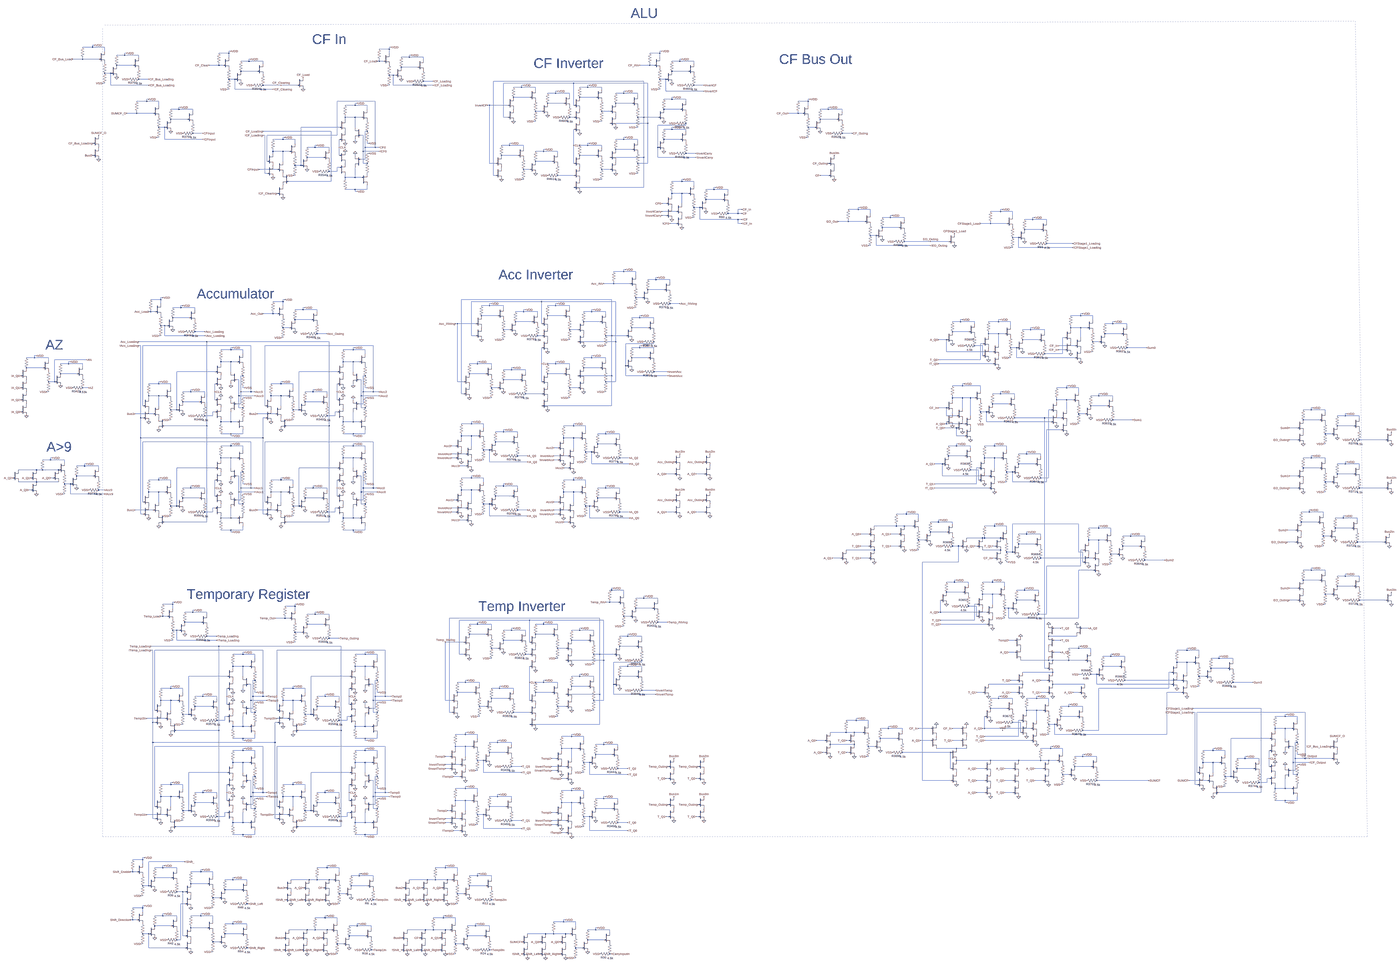
[diagram p0: schematic alu.asc, whole sheet]
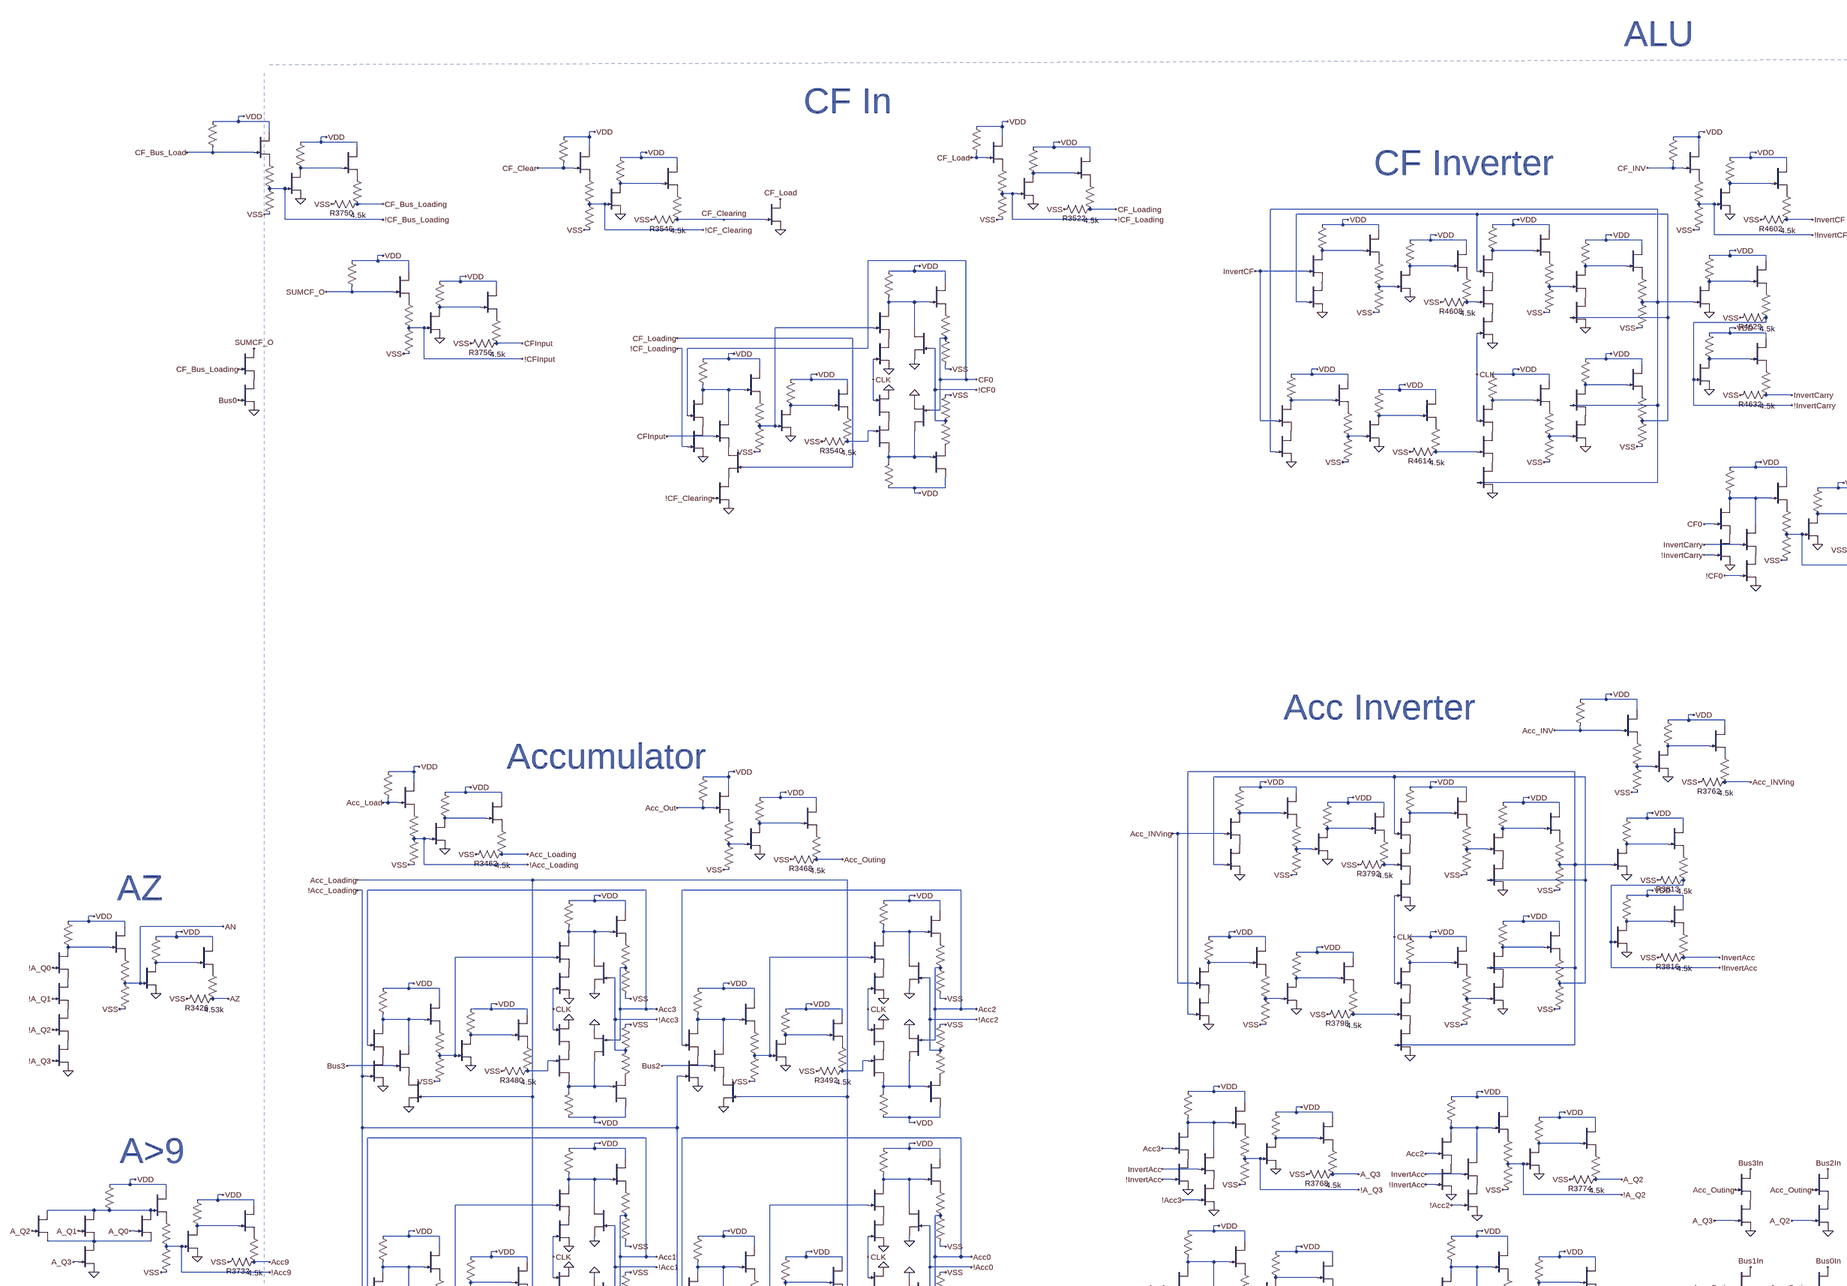
[diagram p1: schematic alu.asc, part, row 1 of 2, column 1 of 2]
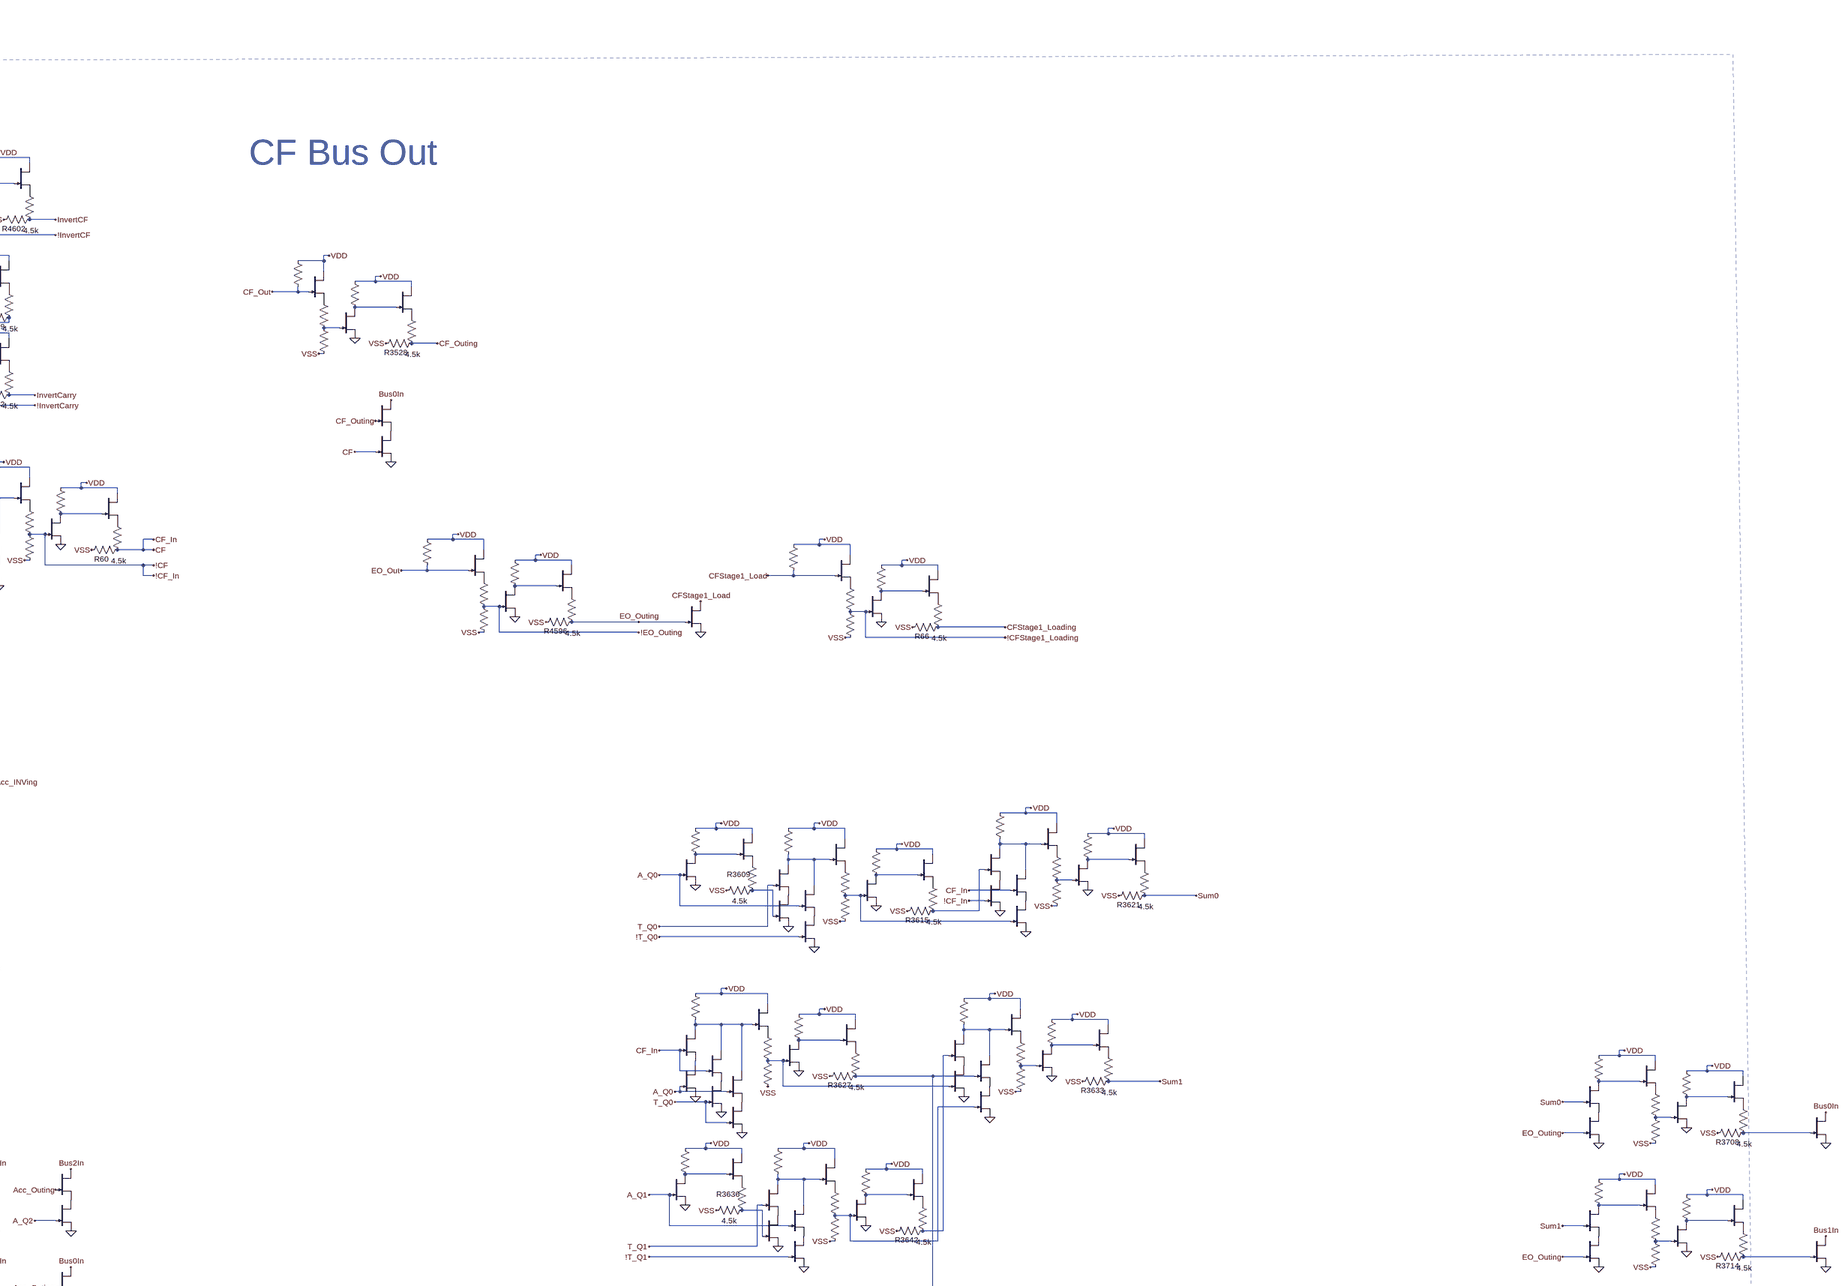
[diagram p2: schematic alu.asc, part, row 1 of 2, column 2 of 2]
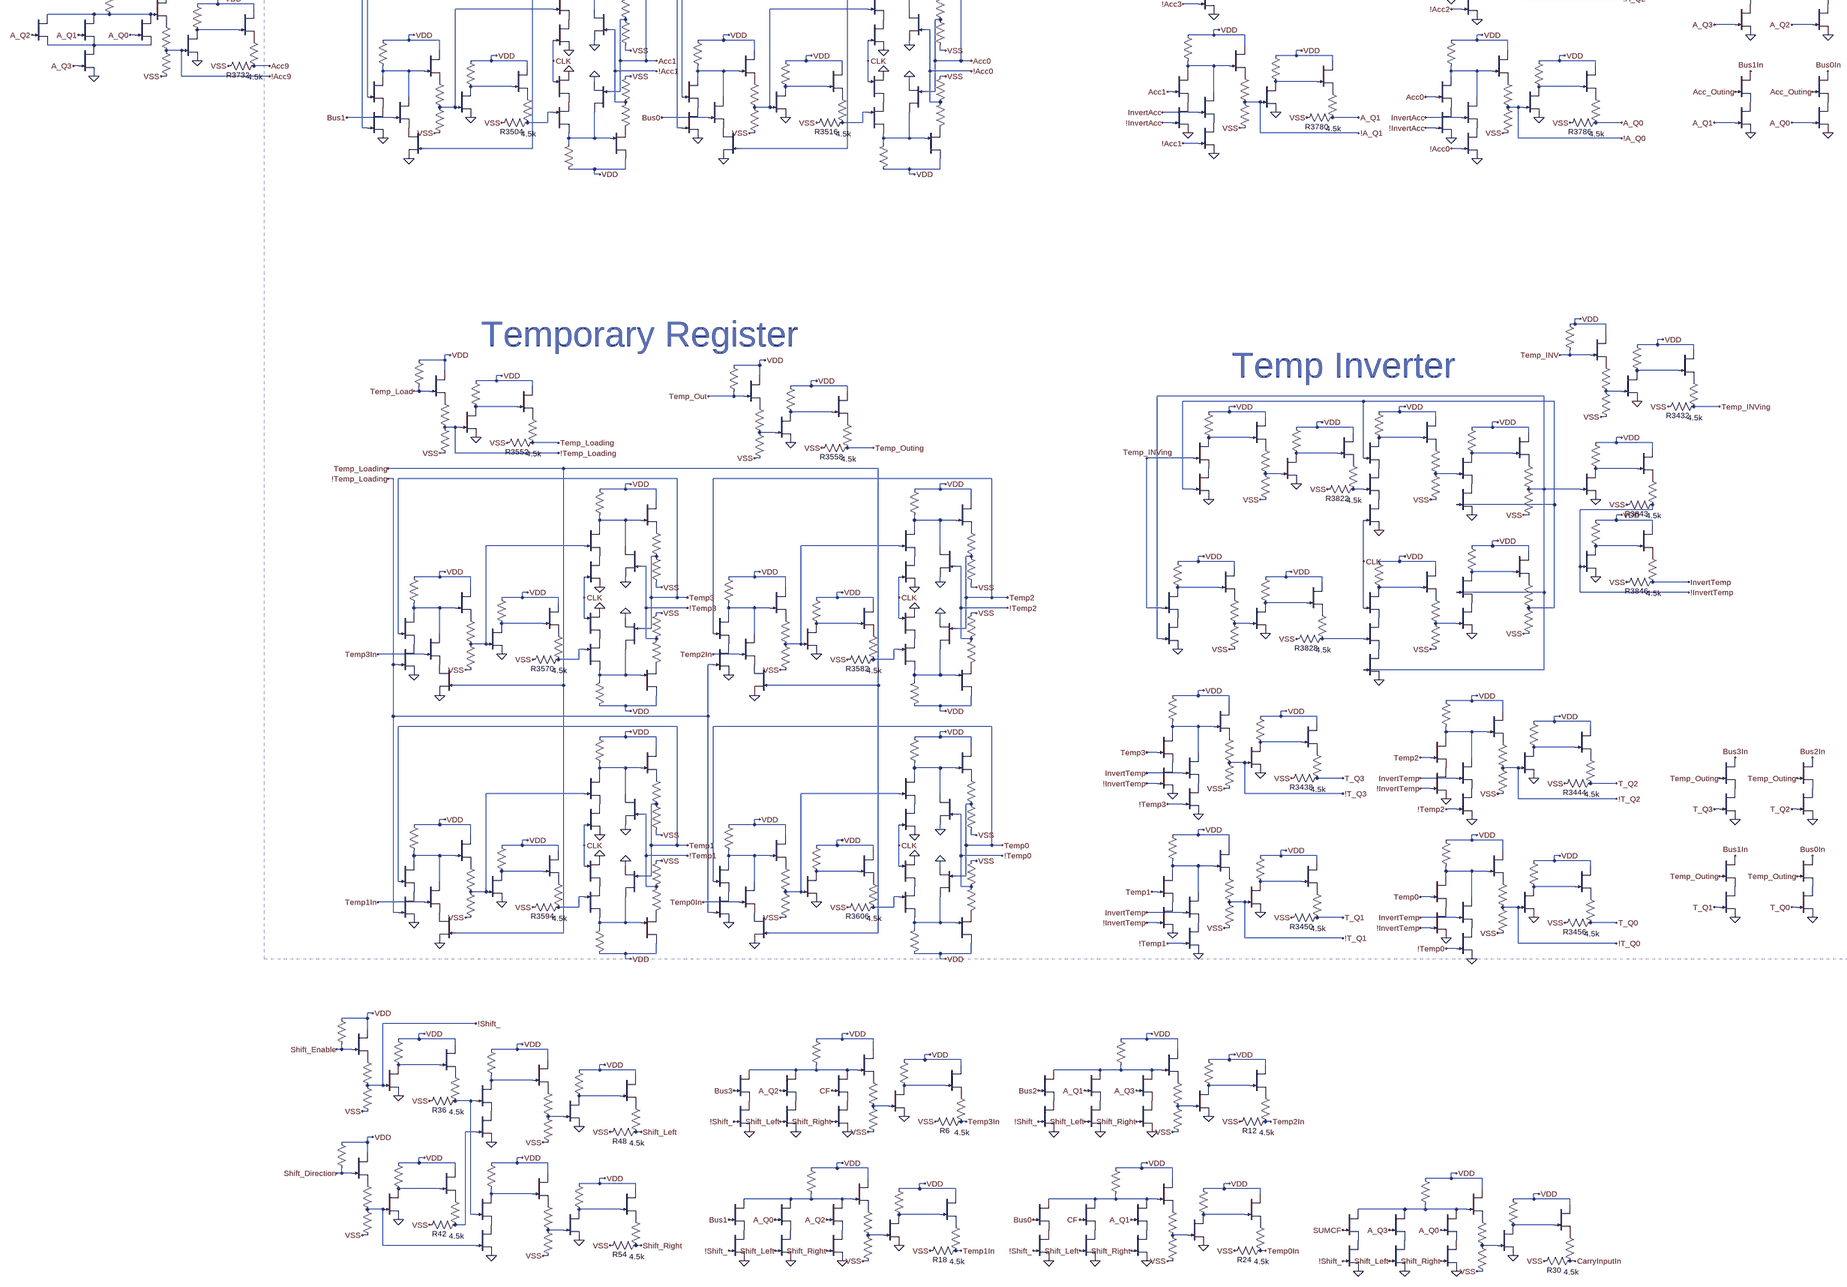
[diagram p3: schematic alu.asc, part, row 2 of 2, column 1 of 2]
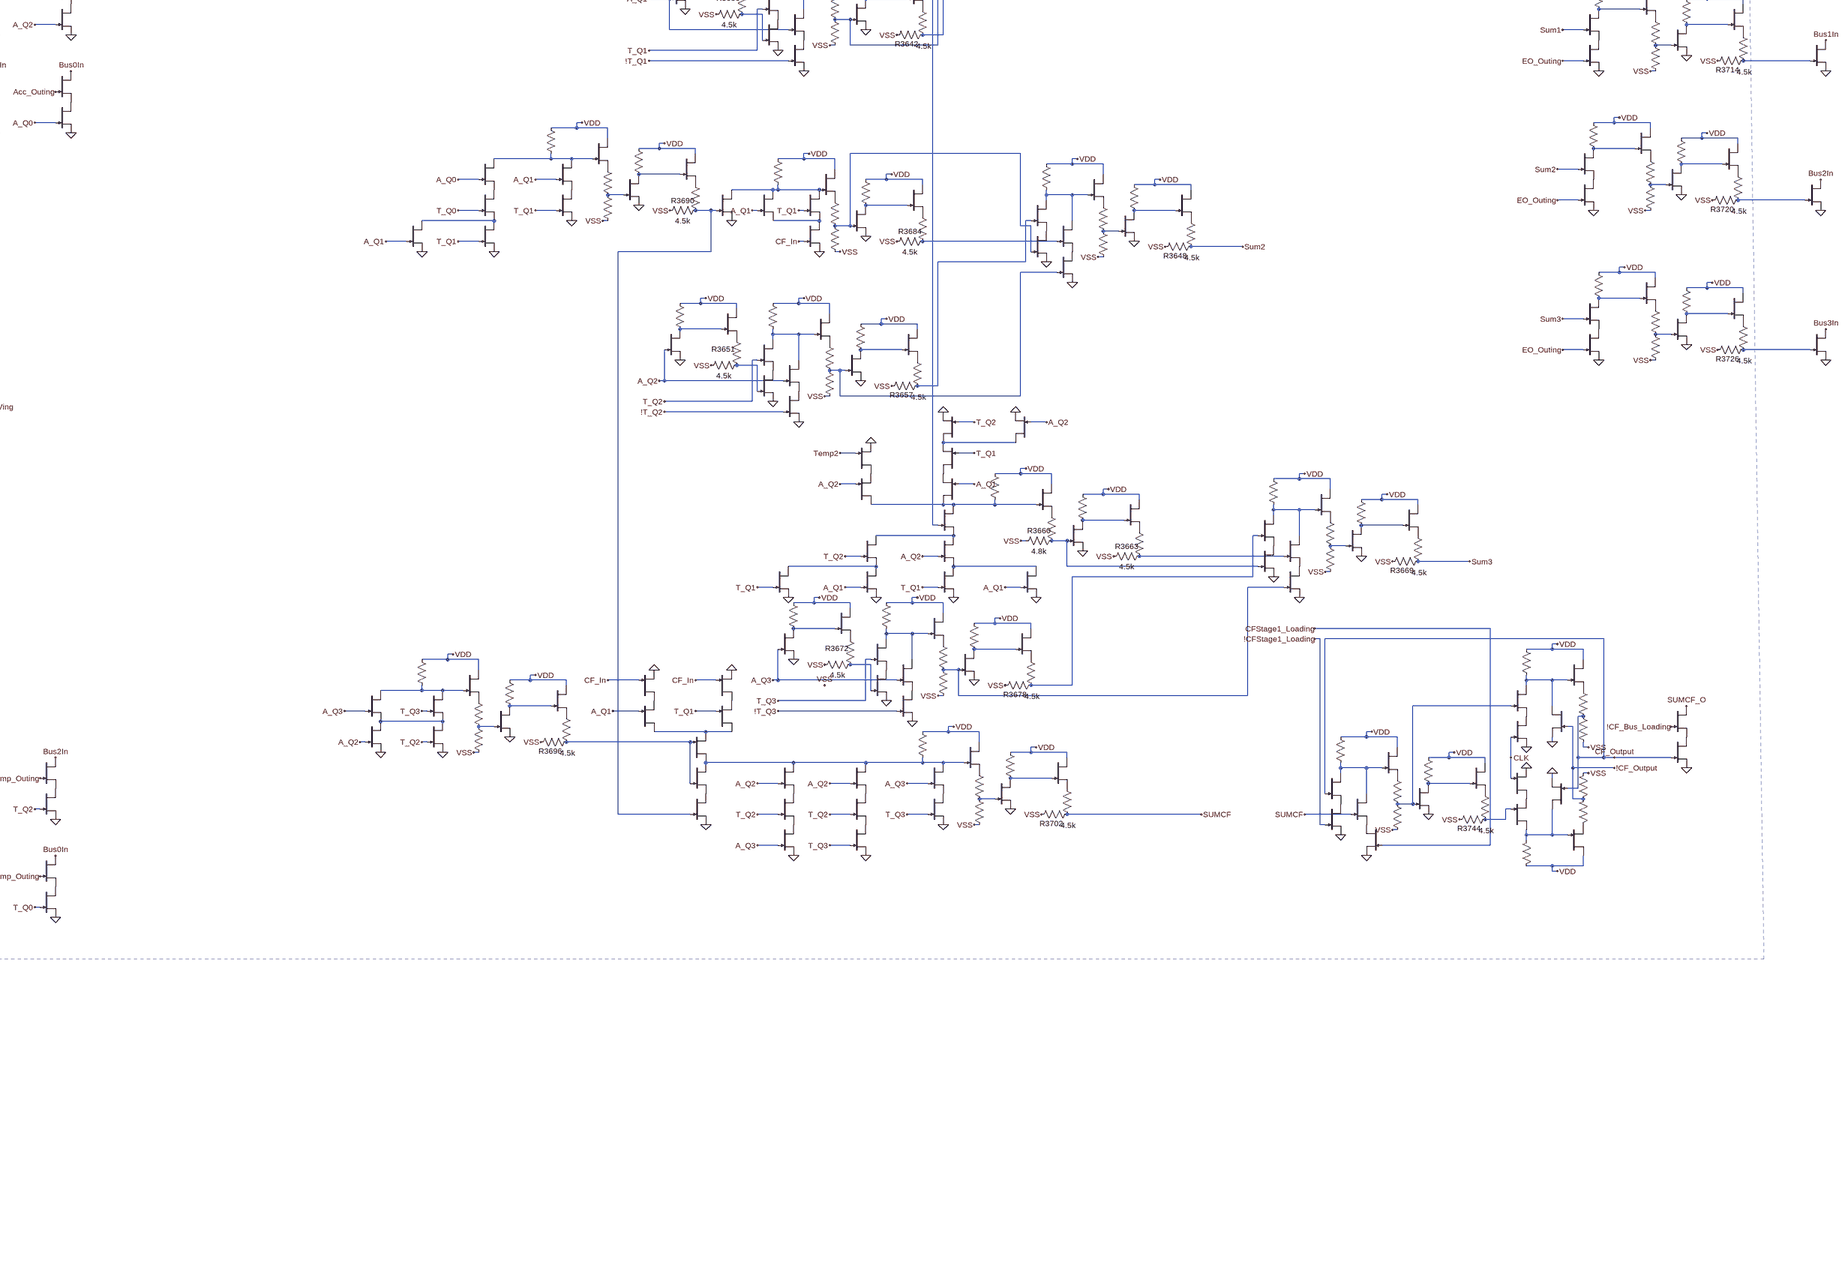
[diagram p4: schematic alu.asc, part, row 2 of 2, column 2 of 2]
* alu.asc
J_A2103 N063 !A_Q0 P001 DR
R3421 VDD N063 100k
J_F874 VDD N063 P002 DR
R3422 P002 AN 1k
R3423 AN VSS 4.8k
J_B993 P001 !A_Q1 P003 DR
J_A2104 N067 AN 0 DR
R3424 VDD N067 50k
J_F875 VDD N067 P004 DR
R3425 P004 AZ 1k
R3426 AZ VSS 4.53k
J_C1 P003 !A_Q2 P005 DR
J_D1 P005 !A_Q3 0 DR
J_A2105 P006 T_Q3 0 DR
J_A2106 Bus3In Temp_Outing P006 DR
J_A2107 P007 T_Q2 0 DR
J_A2108 Bus2In Temp_Outing P007 DR
J_A2109 P008 T_Q1 0 DR
J_A2110 Bus1In Temp_Outing P008 DR
J_A2111 P009 T_Q0 0 DR
J_A2112 Bus0In Temp_Outing P009 DR
R3427 VDD Temp_INV 100k
J_F876 VDD Temp_INV P010 DR
R3428 P010 N155 1k
R3429 N155 VSS 4.8k
J_A2113 N154 N155 0 DR
R3430 VDD N154 50k
J_A2114 VDD N154 P011 DR
R3431 P011 Temp_INVing 1k
R3432 Temp_INVing VSS 4.5k
J_A2115 N211 Temp3 P012 DR
R3433 VDD N211 100k
J_F877 VDD N211 P013 DR
R3434 P013 !T_Q3 1k
R3435 !T_Q3 VSS 4.8k
J_B994 N211 InvertTemp P014 DR
J_A2116 N215 !T_Q3 0 DR
R3436 VDD N215 50k
J_A2117 VDD N215 P015 DR
R3437 P015 T_Q3 1k
R3438 T_Q3 VSS 4.5k
J_A2118 P012 !InvertTemp 0 DR
J_B995 P014 !Temp3 0 DR
J_A2119 N213 Temp2 P016 DR
R3439 VDD N213 100k
J_F878 VDD N213 P017 DR
R3440 P017 !T_Q2 1k
R3441 !T_Q2 VSS 4.8k
J_B996 N213 InvertTemp P018 DR
J_A2120 N217 !T_Q2 0 DR
R3442 VDD N217 50k
J_A2121 VDD N217 P019 DR
R3443 P019 T_Q2 1k
R3444 T_Q2 VSS 4.5k
J_A2122 P016 !InvertTemp 0 DR
J_B997 P018 !Temp2 0 DR
J_A2123 N231 Temp1 P020 DR
R3445 VDD N231 100k
J_F879 VDD N231 P021 DR
R3446 P021 !T_Q1 1k
R3447 !T_Q1 VSS 4.8k
J_B998 N231 InvertTemp P022 DR
J_A2124 N235 !T_Q1 0 DR
R3448 VDD N235 50k
J_A2125 VDD N235 P023 DR
R3449 P023 T_Q1 1k
R3450 T_Q1 VSS 4.5k
J_A2126 P020 !InvertTemp 0 DR
J_B999 P022 !Temp1 0 DR
J_A2127 N234 Temp0 P024 DR
R3451 VDD N234 100k
J_F880 VDD N234 P025 DR
R3452 P025 !T_Q0 1k
R3453 !T_Q0 VSS 4.8k
J_B1000 N234 InvertTemp P026 DR
J_A2128 N236 !T_Q0 0 DR
R3454 VDD N236 50k
J_A2129 VDD N236 P027 DR
R3455 P027 T_Q0 1k
R3456 T_Q0 VSS 4.5k
J_A2130 P024 !InvertTemp 0 DR
J_B1001 P026 !Temp0 0 DR
R3457 VDD Acc_Load 100k
J_F881 VDD Acc_Load P028 DR
R3458 P028 !Acc_Loading 1k
R3459 !Acc_Loading VSS 4.8k
J_A2131 N042 !Acc_Loading 0 DR
R3460 VDD N042 50k
J_A2132 VDD N042 P029 DR
R3461 P029 Acc_Loading 1k
R3462 Acc_Loading VSS 4.5k
R3463 VDD Acc_Out 100k
J_F882 VDD Acc_Out P030 DR
R3464 P030 N046 1k
R3465 N046 VSS 4.8k
J_A2133 N043 N046 0 DR
R3466 VDD N043 50k
J_A2134 VDD N043 P031 DR
R3467 P031 Acc_Outing 1k
R3468 Acc_Outing VSS 4.5k
J_A2135 N061 N065 P032 DR
R3469 VDD N061 100k
J_F883 VDD N061 P033 DR
R3470 P033 Acc3 1k
R3471 Acc3 VSS 4.8k
J_B1002 N061 !Acc3 0 DR
J_A2136 N090 N083 P034 DR
R3472 VDD N090 100k
J_F884 VDD N090 P035 DR
R3473 P035 !Acc3 1k
R3474 !Acc3 VSS 4.8k
J_B1003 N090 Acc3 0 DR
J_A2137 P032 CLK 0 DR
J_A2138 P034 CLK 0 DR
J_A2139 N074 Acc3 P036 DR
R3475 VDD N074 100k
J_F885 VDD N074 P037 DR
R3476 P037 N065 1k
R3477 N065 VSS 4.8k
J_B1004 N074 Bus3 P038 DR
J_A2140 N078 N065 0 DR
R3478 VDD N078 50k
J_A2141 VDD N078 P039 DR
R3479 P039 N083 1k
R3480 N083 VSS 4.5k
J_A2142 P036 !Acc_Loading 0 DR
J_B1005 P038 Acc_Loading 0 DR
J_A2143 N062 N066 P040 DR
R3481 VDD N062 100k
J_F886 VDD N062 P041 DR
R3482 P041 Acc2 1k
R3483 Acc2 VSS 4.8k
J_B1006 N062 !Acc2 0 DR
J_A2144 N091 N084 P042 DR
R3484 VDD N091 100k
J_F887 VDD N091 P043 DR
R3485 P043 !Acc2 1k
R3486 !Acc2 VSS 4.8k
J_B1007 N091 Acc2 0 DR
J_A2145 P040 CLK 0 DR
J_A2146 P042 CLK 0 DR
J_A2147 N075 Acc2 P044 DR
R3487 VDD N075 100k
J_F888 VDD N075 P045 DR
R3488 P045 N066 1k
R3489 N066 VSS 4.8k
J_B1008 N075 Bus2 P046 DR
J_A2148 N079 N066 0 DR
R3490 VDD N079 50k
J_A2149 VDD N079 P047 DR
R3491 P047 N084 1k
R3492 N084 VSS 4.5k
J_A2150 P044 !Acc_Loading 0 DR
J_B1009 P046 Acc_Loading 0 DR
J_A2151 N101 N105 P048 DR
R3493 VDD N101 100k
J_F889 VDD N101 P049 DR
R3494 P049 Acc1 1k
R3495 Acc1 VSS 4.8k
J_B1010 N101 !Acc1 0 DR
J_A2152 N125 N123 P050 DR
R3496 VDD N125 100k
J_F890 VDD N125 P051 DR
R3497 P051 !Acc1 1k
R3498 !Acc1 VSS 4.8k
J_B1011 N125 Acc1 0 DR
J_A2153 P048 CLK 0 DR
J_A2154 P050 CLK 0 DR
J_A2155 N116 Acc1 P052 DR
R3499 VDD N116 100k
J_F891 VDD N116 P053 DR
R3500 P053 N105 1k
R3501 N105 VSS 4.8k
J_B1012 N116 Bus1 P054 DR
J_A2156 N120 N105 0 DR
R3502 VDD N120 50k
J_A2157 VDD N120 P055 DR
R3503 P055 N123 1k
R3504 N123 VSS 4.5k
J_A2158 P052 !Acc_Loading 0 DR
J_B1013 P054 Acc_Loading 0 DR
J_A2159 N102 N106 P056 DR
R3505 VDD N102 100k
J_F892 VDD N102 P057 DR
R3506 P057 Acc0 1k
R3507 Acc0 VSS 4.8k
J_B1014 N102 !Acc0 0 DR
J_A2160 N126 N124 P058 DR
R3508 VDD N126 100k
J_F893 VDD N126 P059 DR
R3509 P059 !Acc0 1k
R3510 !Acc0 VSS 4.8k
J_B1015 N126 Acc0 0 DR
J_A2161 P056 CLK 0 DR
J_A2162 P058 CLK 0 DR
J_A2163 N117 Acc0 P060 DR
R3511 VDD N117 100k
J_F894 VDD N117 P061 DR
R3512 P061 N106 1k
R3513 N106 VSS 4.8k
J_B1016 N117 Bus0 P062 DR
J_A2164 N121 N106 0 DR
R3514 VDD N121 50k
J_A2165 VDD N121 P063 DR
R3515 P063 N124 1k
R3516 N124 VSS 4.5k
J_A2166 P060 !Acc_Loading 0 DR
J_B1017 P062 Acc_Loading 0 DR
R3517 VDD CF_Load 100k
J_F895 VDD CF_Load P064 DR
R3518 P064 !CF_Loading 1k
R3519 !CF_Loading VSS 4.8k
J_A2167 N002 !CF_Loading 0 DR
R3520 VDD N002 50k
J_A2168 VDD N002 P065 DR
R3521 P065 CF_Loading 1k
R3522 CF_Loading VSS 4.5k
R3523 VDD CF_Out 100k
J_F896 VDD CF_Out P066 DR
R3524 P066 N019 1k
R3525 N019 VSS 4.8k
J_A2169 N017 N019 0 DR
R3526 VDD N017 50k
J_A2170 VDD N017 P067 DR
R3527 P067 CF_Outing 1k
R3528 CF_Outing VSS 4.5k
J_A2171 N014 N018 P068 DR
R3529 VDD N014 100k
J_F897 VDD N014 P069 DR
R3530 P069 CF0 1k
R3531 CF0 VSS 4.8k
J_B1018 N014 !CF0 0 DR
J_A2172 N031 N027 P070 DR
R3532 VDD N031 100k
J_F898 VDD N031 P071 DR
R3533 P071 !CF0 1k
R3534 !CF0 VSS 4.8k
J_B1019 N031 CF0 0 DR
J_A2173 P068 CLK 0 DR
J_A2174 P070 CLK 0 DR
J_A2175 N022 CF0 P072 DR
R3535 VDD N022 100k
J_F899 VDD N022 P073 DR
R3536 P073 N018 1k
R3537 N018 VSS 4.8k
J_B1020 N022 CFInput P074 DR
J_A2176 N025 N018 0 DR
R3538 VDD N025 50k
J_A2177 VDD N025 P075 DR
R3539 P075 N027 1k
R3540 N027 VSS 4.5k
J_A2178 P072 !CF_Loading 0 DR
J_B1021 P074 CF_Loading P076 DR
R3541 VDD CF_Clear 100k
J_F900 VDD CF_Clear P077 DR
R3542 P077 !CF_Clearing 1k
R3543 !CF_Clearing VSS 4.8k
J_A2179 N003 !CF_Clearing 0 DR
R3544 VDD N003 50k
J_A2180 VDD N003 P078 DR
R3545 P078 CF_Clearing 1k
R3546 CF_Clearing VSS 4.5k
J_A2181 P079 CF_In 0 DR
J_A2182 Bus0In CF_Outing P079 DR
J_B1022 CF_Load CF_Clearing 0 DR
J_B1023 P076 !CF_Clearing 0 DR
R3547 VDD Temp_Load 100k
J_F901 VDD Temp_Load P080 DR
R3548 P080 !Temp_Loading 1k
R3549 !Temp_Loading VSS 4.8k
J_A2183 N158 !Temp_Loading 0 DR
R3550 VDD N158 50k
J_A2184 VDD N158 P081 DR
R3551 P081 Temp_Loading 1k
R3552 Temp_Loading VSS 4.5k
R3553 VDD Temp_Out 100k
J_F902 VDD Temp_Out P082 DR
R3554 P082 N160 1k
R3555 N160 VSS 4.8k
J_A2185 N159 N160 0 DR
R3556 VDD N159 50k
J_A2186 VDD N159 P083 DR
R3557 P083 Temp_Outing 1k
R3558 Temp_Outing VSS 4.5k
J_A2187 N172 N179 P084 DR
R3559 VDD N172 100k
J_F903 VDD N172 P085 DR
R3560 P085 Temp3 1k
R3561 Temp3 VSS 4.8k
J_B1024 N172 !Temp3 0 DR
J_A2188 N204 N200 P086 DR
R3562 VDD N204 100k
J_F904 VDD N204 P087 DR
R3563 P087 !Temp3 1k
R3564 !Temp3 VSS 4.8k
J_B1025 N204 Temp3 0 DR
J_A2189 P084 CLK 0 DR
J_A2190 P086 CLK 0 DR
J_A2191 N191 Temp3 P088 DR
R3565 VDD N191 100k
J_F905 VDD N191 P089 DR
R3566 P089 N179 1k
R3567 N179 VSS 4.8k
J_B1026 N191 Temp3In P090 DR
J_A2192 N193 N179 0 DR
R3568 VDD N193 50k
J_A2193 VDD N193 P091 DR
R3569 P091 N200 1k
R3570 N200 VSS 4.5k
J_A2194 P088 !Temp_Loading 0 DR
J_B1027 P090 Temp_Loading 0 DR
J_A2195 N173 N180 P092 DR
R3571 VDD N173 100k
J_F906 VDD N173 P093 DR
R3572 P093 Temp2 1k
R3573 Temp2 VSS 4.8k
J_B1028 N173 !Temp2 0 DR
J_A2196 N205 N201 P094 DR
R3574 VDD N205 100k
J_F907 VDD N205 P095 DR
R3575 P095 !Temp2 1k
R3576 !Temp2 VSS 4.8k
J_B1029 N205 Temp2 0 DR
J_A2197 P092 CLK 0 DR
J_A2198 P094 CLK 0 DR
J_A2199 N192 Temp2 P096 DR
R3577 VDD N192 100k
J_F908 VDD N192 P097 DR
R3578 P097 N180 1k
R3579 N180 VSS 4.8k
J_B1030 N192 Temp2In P098 DR
J_A2200 N194 N180 0 DR
R3580 VDD N194 50k
J_A2201 VDD N194 P099 DR
R3581 P099 N201 1k
R3582 N201 VSS 4.5k
J_A2202 P096 !Temp_Loading 0 DR
J_B1031 P098 Temp_Loading 0 DR
J_A2203 N219 N224 P100 DR
R3583 VDD N219 100k
J_F909 VDD N219 P101 DR
R3584 P101 Temp1 1k
R3585 Temp1 VSS 4.8k
J_B1032 N219 !Temp1 0 DR
J_A2204 N239 N237 P102 DR
R3586 VDD N239 100k
J_F910 VDD N239 P103 DR
R3587 P103 !Temp1 1k
R3588 !Temp1 VSS 4.8k
J_B1033 N239 Temp1 0 DR
J_A2205 P100 CLK 0 DR
J_A2206 P102 CLK 0 DR
J_A2207 N229 Temp1 P104 DR
R3589 VDD N229 100k
J_F911 VDD N229 P105 DR
R3590 P105 N224 1k
R3591 N224 VSS 4.8k
J_B1034 N229 Temp1In P106 DR
J_A2208 N232 N224 0 DR
R3592 VDD N232 50k
J_A2209 VDD N232 P107 DR
R3593 P107 N237 1k
R3594 N237 VSS 4.5k
J_A2210 P104 !Temp_Loading 0 DR
J_B1035 P106 Temp_Loading 0 DR
J_A2211 N220 N225 P108 DR
R3595 VDD N220 100k
J_F912 VDD N220 P109 DR
R3596 P109 Temp0 1k
R3597 Temp0 VSS 4.8k
J_B1036 N220 !Temp0 0 DR
J_A2212 N240 N238 P110 DR
R3598 VDD N240 100k
J_F913 VDD N240 P111 DR
R3599 P111 !Temp0 1k
R3600 !Temp0 VSS 4.8k
J_B1037 N240 Temp0 0 DR
J_A2213 P108 CLK 0 DR
J_A2214 P110 CLK 0 DR
J_A2215 N230 Temp0 P112 DR
R3601 VDD N230 100k
J_F914 VDD N230 P113 DR
R3602 P113 N225 1k
R3603 N225 VSS 4.8k
J_B1038 N230 Temp0In P114 DR
J_A2216 N233 N225 0 DR
R3604 VDD N233 50k
J_A2217 VDD N233 P115 DR
R3605 P115 N238 1k
R3606 N238 VSS 4.5k
J_A2218 P112 !Temp_Loading 0 DR
J_B1039 P114 Temp_Loading 0 DR
J_A2219 N133 A_Q1 N141 DR
J_A2220 N051 A_Q0 0 DR
R3607 VDD N051 50k
J_A2221 VDD N051 P116 DR
R3608 P116 N058 1k
R3609 N058 VSS 4.5k
J_A2222 N052 T_Q0 P117 DR
R3610 VDD N052 100k
J_F915 VDD N052 P118 DR
R3611 P118 N059 1k
R3612 N059 VSS 4.8k
J_B1040 N052 A_Q0 P119 DR
J_A2223 N056 N059 0 DR
R3613 VDD N056 50k
J_A2224 VDD N056 P120 DR
R3614 P120 N055 1k
R3615 N055 VSS 4.5k
J_A2225 P117 N058 0 DR
J_B1041 P119 !T_Q0 0 DR
J_A2226 N048 N055 P121 DR
R3616 VDD N048 100k
J_F916 VDD N048 P122 DR
R3617 P122 N057 1k
R3618 N057 VSS 4.8k
J_B1042 N048 CF_In P123 DR
J_A2227 N053 N057 0 DR
R3619 VDD N053 50k
J_A2228 VDD N053 P124 DR
R3620 P124 Sum0 1k
R3621 Sum0 VSS 4.5k
J_A2229 P121 !CF 0 DR
J_B1043 P123 N059 0 DR
J_A2230 N076 CF_In N086 DR
R3622 VDD N076 100k
J_F917 VDD N076 P125 DR
R3623 P125 N085 1k
R3624 N085 VSS 4.8k
J_B1044 N076 CF_In P126 DR
J_A2231 N080 N085 0 DR
R3625 VDD N080 50k
J_A2232 VDD N080 P127 DR
R3626 P127 N088 1k
R3627 N088 VSS 4.5k
J_A2233 N086 A_Q0 0 DR
J_B1045 P126 T_Q0 0 DR
J_B1046 N076 A_Q0 P128 DR
J_B1047 P128 T_Q0 0 DR
J_A2234 N077 N082 P129 DR
R3628 VDD N077 100k
J_F918 VDD N077 P130 DR
R3629 P130 N087 1k
R3630 N087 VSS 4.8k
J_B1048 N077 N088 P131 DR
J_A2235 N081 N087 0 DR
R3631 VDD N081 50k
J_A2236 VDD N081 P132 DR
R3632 P132 Sum1 1k
R3633 Sum1 VSS 4.5k
J_A2237 P129 N085 0 DR
J_B1049 P131 N093 0 DR
J_A2238 N100 A_Q1 0 DR
R3634 VDD N100 50k
J_A2239 VDD N100 P133 DR
R3635 P133 N109 1k
R3636 N109 VSS 4.5k
J_A2240 N103 T_Q1 P134 DR
R3637 VDD N103 100k
J_F919 VDD N103 P135 DR
R3638 P135 N093 1k
R3639 N093 VSS 4.8k
J_B1050 N103 A_Q1 P136 DR
J_A2241 N104 N093 0 DR
R3640 VDD N104 50k
J_A2242 VDD N104 P137 DR
R3641 P137 N082 1k
R3642 N082 VSS 4.5k
J_A2243 P134 N109 0 DR
J_B1051 P136 !T_Q1 0 DR
J_A2244 N133 T_Q1 N141 DR
J_A2245 N135 N142 P138 DR
R3643 VDD N135 100k
J_F920 VDD N135 P139 DR
R3644 P139 N143 1k
R3645 N143 VSS 4.8k
J_B1052 N135 N144 P140 DR
J_A2246 N139 N143 0 DR
R3646 VDD N139 50k
J_A2247 VDD N139 P141 DR
R3647 P141 Sum2 1k
R3648 Sum2 VSS 4.5k
J_A2248 P138 N128 0 DR
J_B1053 P140 N145 0 DR
J_A2249 N148 A_Q2 0 DR
R3649 VDD N148 50k
J_A2250 VDD N148 P142 DR
R3650 P142 N153 1k
R3651 N153 VSS 4.5k
J_A2251 N149 T_Q2 P143 DR
R3652 VDD N149 100k
J_F921 VDD N149 P144 DR
R3653 P144 N145 1k
R3654 N145 VSS 4.8k
J_B1054 N149 A_Q2 P145 DR
J_A2252 N151 N145 0 DR
R3655 VDD N151 50k
J_A2253 VDD N151 P146 DR
R3656 P146 N142 1k
R3657 N142 VSS 4.5k
J_A2254 P143 N153 0 DR
J_B1055 P145 !T_Q2 0 DR
R3658 VDD N170 100k
J_F922 VDD N170 P147 DR
R3659 P147 N178 1k
R3660 N178 VSS 4.8k
J_A2255 N174 N178 0 DR
R3661 VDD N174 50k
J_A2256 VDD N174 P148 DR
R3662 P148 N183 1k
R3663 N183 VSS 4.5k
J_A2257 N170 A_Q2 P149 DR
J_B1056 P149 Temp2 0 DR
J_A2258 N170 A_Q1 P150 DR
J_B1057 P150 T_Q1 N163 DR
J_B1058 N163 T_Q2 0 DR
J_B1059 N163 A_Q2 0 DR
J_A2259 N185 A_Q1 0 DR
J_A2260 N176 T_Q2 N184 DR
J_B1060 N184 A_Q1 0 DR
J_A2261 N185 T_Q1 0 DR
J_B1061 N176 A_Q2 N185 DR
J_B1062 N184 T_Q1 0 DR
J_B1063 N170 N088 N176 DR
J_A2262 N171 N177 P151 DR
R3664 VDD N171 100k
J_F923 VDD N171 P152 DR
R3665 P152 N182 1k
R3666 N182 VSS 4.8k
J_B1064 N171 N183 P153 DR
J_A2263 N175 N182 0 DR
R3667 VDD N175 50k
J_A2264 VDD N175 P154 DR
R3668 P154 Sum3 1k
R3669 Sum3 VSS 4.5k
J_A2265 P151 N178 0 DR
J_B1065 P153 N189 0 DR
J_A2266 N197 A_Q3 0 DR
R3670 VDD N197 50k
J_A2267 VDD N197 P155 DR
R3671 P155 N203 1k
R3672 N203 VSS 4.5k
J_A2268 N198 T_Q3 P156 DR
R3673 VDD N198 100k
J_F924 VDD N198 P157 DR
R3674 P157 N189 1k
R3675 N189 VSS 4.8k
J_B1066 N198 A_Q3 P158 DR
J_A2269 N202 N189 0 DR
R3676 VDD N202 50k
J_A2270 VDD N202 P159 DR
R3677 P159 N177 1k
R3678 N177 VSS 4.5k
J_A2271 P156 N203 0 DR
J_B1067 P158 !T_Q3 0 DR
R3679 VDD N133 100k
J_F925 VDD N133 P160 DR
R3680 P160 N128 1k
R3681 N128 VSS 4.8k
J_A2272 N137 N128 0 DR
R3682 VDD N137 50k
J_A2273 VDD N137 P161 DR
R3683 P161 N144 1k
R3684 N144 VSS 4.5k
J_A2274 N129 A_Q1 P162 DR
J_B1068 P162 T_Q1 0 DR
J_A2275 N129 A_Q0 P163 DR
J_B1069 P163 T_Q0 N140 DR
R3685 VDD N129 100k
J_F926 VDD N129 P164 DR
R3686 P164 N134 1k
R3687 N134 VSS 4.8k
J_A2276 N131 N134 0 DR
R3688 VDD N131 50k
J_A2277 VDD N131 P165 DR
R3689 P165 N138 1k
R3690 N138 VSS 4.5k
J_B1070 N140 A_Q1 0 DR
J_B1071 N140 T_Q1 0 DR
J_B1072 N141 CF_In 0 DR
J_A2278 N133 N138 0 DR
J_A2279 N218 N216 P166 DR
J_B1073 P166 N138 0 DR
J_A2280 N214 T_Q1 P167 DR
J_B1074 P167 CF_In 0 DR
J_A2281 N214 A_Q1 P168 DR
J_B1075 P168 CF_In 0 DR
R3691 VDD N207 100k
J_F927 VDD N207 P169 DR
R3692 P169 N212 1k
R3693 N212 VSS 4.8k
J_A2282 N208 N212 0 DR
R3694 VDD N208 50k
J_A2283 VDD N208 P170 DR
R3695 P170 N216 1k
R3696 N216 VSS 4.5k
J_A2284 N207 A_Q3 N210 DR
J_A2285 N207 T_Q3 N210 DR
J_B1076 N210 A_Q2 0 DR
J_B1077 N210 T_Q2 0 DR
J_A2286 N218 A_Q3 P171 DR
J_B1078 P171 T_Q3 0 DR
J_A2287 N218 A_Q2 P172 DR
J_B1079 P172 T_Q2 P173 DR
J_B1080 P173 T_Q3 0 DR
J_A2288 N218 A_Q2 P174 DR
J_B1081 P174 T_Q2 P175 DR
J_B1082 P175 A_Q3 0 DR
J_A2289 N218 N216 N214 DR
R3697 VDD N218 100k
J_F928 VDD N218 P176 DR
R3698 P176 N226 1k
R3699 N226 VSS 4.8k
J_A2290 N222 N226 0 DR
R3700 VDD N222 50k
J_A2291 VDD N222 P177 DR
R3701 P177 SUMCF 1k
R3702 SUMCF VSS 4.5k
J_A2292 N089 Sum0 P178 DR
R3703 VDD N089 100k
J_F929 VDD N089 P179 DR
R3704 P179 N094 1k
R3705 N094 VSS 4.8k
J_B1083 P178 EO_Outing 0 DR
J_A2293 N092 N094 0 DR
R3706 VDD N092 50k
J_F930 VDD N092 P180 DR
R3707 P180 N097 1k
R3708 N097 VSS 4.5k
J_A2294 Bus0In N097 0 DR
J_A2295 N107 Sum1 P181 DR
R3709 VDD N107 100k
J_F931 VDD N107 P182 DR
R3710 P182 N113 1k
R3711 N113 VSS 4.8k
J_B1084 P181 EO_Outing 0 DR
J_A2296 N110 N113 0 DR
R3712 VDD N110 50k
J_F932 VDD N110 P183 DR
R3713 P183 N114 1k
R3714 N114 VSS 4.5k
J_A2297 Bus1In N114 0 DR
J_A2298 N127 Sum2 P184 DR
R3715 VDD N127 100k
J_F933 VDD N127 P185 DR
R3716 P185 N132 1k
R3717 N132 VSS 4.8k
J_B1085 P184 EO_Outing 0 DR
J_A2299 N130 N132 0 DR
R3718 VDD N130 50k
J_F934 VDD N130 P186 DR
R3719 P186 N136 1k
R3720 N136 VSS 4.5k
J_A2300 Bus2In N136 0 DR
J_A2301 N146 Sum3 P187 DR
R3721 VDD N146 100k
J_F935 VDD N146 P188 DR
R3722 P188 N150 1k
R3723 N150 VSS 4.8k
J_B1086 P187 EO_Outing 0 DR
J_A2302 N147 N150 0 DR
R3724 VDD N147 50k
J_F936 VDD N147 P189 DR
R3725 P189 N152 1k
R3726 N152 VSS 4.5k
J_A2303 Bus3In N152 0 DR
J_A2304 N108 A_Q0 N112 DR
R3727 VDD N108 100k
J_F937 VDD N108 P190 DR
R3728 P190 !Acc9 1k
R3729 !Acc9 VSS 4.8k
J_B1087 N108 A_Q1 N112 DR
J_A2305 N111 !Acc9 0 DR
R3730 VDD N111 50k
J_F938 VDD N111 P191 DR
R3731 P191 Acc9 1k
R3732 Acc9 VSS 4.5k
J_A2306 N112 A_Q3 0 DR
J_B1088 N108 A_Q2 N112 DR
J_A2307 N206 N209 P192 DR
R3733 VDD N206 100k
J_F939 VDD N206 P193 DR
R3734 P193 CF_Output 1k
R3735 CF_Output VSS 4.8k
J_B1089 N206 !CF_Output 0 DR
J_A2308 N228 N227 P194 DR
R3736 VDD N228 100k
J_F940 VDD N228 P195 DR
R3737 P195 !CF_Output 1k
R3738 !CF_Output VSS 4.8k
J_B1090 N228 CF_Output 0 DR
J_A2309 P192 CLK 0 DR
J_A2310 P194 CLK 0 DR
J_A2311 N221 CF_Output P196 DR
R3739 VDD N221 100k
J_F941 VDD N221 P197 DR
R3740 P197 N209 1k
R3741 N209 VSS 4.8k
J_B1091 N221 SUMCF P198 DR
J_A2312 N223 N209 0 DR
R3742 VDD N223 50k
J_A2313 VDD N223 P199 DR
R3743 P199 N227 1k
R3744 N227 VSS 4.5k
J_A2314 P196 !CFStage1_Loading 0 DR
J_B1092 P198 CFStage1_Loading 0 DR
R3745 VDD CF_Bus_Load 100k
J_F942 VDD CF_Bus_Load P200 DR
R3746 P200 !CF_Bus_Loading 1k
R3747 !CF_Bus_Loading VSS 4.8k
J_A2315 N001 !CF_Bus_Loading 0 DR
R3748 VDD N001 50k
J_A2316 VDD N001 P201 DR
R3749 P201 CF_Bus_Loading 1k
R3750 CF_Bus_Loading VSS 4.5k
J_A2317 P202 CF_Output 0 DR
J_A2318 SUMCF_O !CF_Bus_Loading P202 DR
J_A2319 SUMCF_O CF_Bus_Loading P203 DR
J_A2320 P203 Bus0 0 DR
R3751 VDD SUMCF_O 100k
J_F943 VDD SUMCF_O P204 DR
R3752 P204 !CFInput 1k
R3753 !CFInput VSS 4.8k
J_A2321 N016 !CFInput 0 DR
R3754 VDD N016 50k
J_A2322 VDD N016 P205 DR
R3755 P205 CFInput 1k
R3756 CFInput VSS 4.5k
J_A2323 P206 A_Q3 0 DR
J_A2324 Bus3In Acc_Outing P206 DR
J_A2325 P207 A_Q2 0 DR
J_A2326 Bus2In Acc_Outing P207 DR
J_A2327 P208 A_Q1 0 DR
J_A2328 Bus1In Acc_Outing P208 DR
J_A2329 P209 A_Q0 0 DR
J_A2330 Bus0In Acc_Outing P209 DR
R3757 VDD Acc_INV 100k
J_F944 VDD Acc_INV P210 DR
R3758 P210 N037 1k
R3759 N037 VSS 4.8k
J_A2331 N036 N037 0 DR
R3760 VDD N036 50k
J_A2332 VDD N036 P211 DR
R3761 P211 Acc_INVing 1k
R3762 Acc_INVing VSS 4.5k
J_A2333 N095 Acc3 P212 DR
R3763 VDD N095 100k
J_F945 VDD N095 P213 DR
R3764 P213 !A_Q3 1k
R3765 !A_Q3 VSS 4.8k
J_B1093 N095 InvertAcc P214 DR
J_A2334 N098 !A_Q3 0 DR
R3766 VDD N098 50k
J_A2335 VDD N098 P215 DR
R3767 P215 A_Q3 1k
R3768 A_Q3 VSS 4.5k
J_A2336 P212 !InvertAcc 0 DR
J_B1094 P214 !Acc3 0 DR
J_A2337 N096 Acc2 P216 DR
R3769 VDD N096 100k
J_F946 VDD N096 P217 DR
R3770 P217 !A_Q2 1k
R3771 !A_Q2 VSS 4.8k
J_B1095 N096 InvertAcc P218 DR
J_A2338 N099 !A_Q2 0 DR
R3772 VDD N099 50k
J_A2339 VDD N099 P219 DR
R3773 P219 A_Q2 1k
R3774 A_Q2 VSS 4.5k
J_A2340 P216 !InvertAcc 0 DR
J_B1096 P218 !Acc2 0 DR
J_A2341 N115 Acc1 P220 DR
R3775 VDD N115 100k
J_F947 VDD N115 P221 DR
R3776 P221 !A_Q1 1k
R3777 !A_Q1 VSS 4.8k
J_B1097 N115 InvertAcc P222 DR
J_A2342 N119 !A_Q1 0 DR
R3778 VDD N119 50k
J_A2343 VDD N119 P223 DR
R3779 P223 A_Q1 1k
R3780 A_Q1 VSS 4.5k
J_A2344 P220 !InvertAcc 0 DR
J_B1098 P222 !Acc1 0 DR
J_A2345 N118 Acc0 P224 DR
R3781 VDD N118 100k
J_F948 VDD N118 P225 DR
R3782 P225 !A_Q0 1k
R3783 !A_Q0 VSS 4.8k
J_B1099 N118 InvertAcc P226 DR
J_A2346 N122 !A_Q0 0 DR
R3784 VDD N122 50k
J_A2347 VDD N122 P227 DR
R3785 P227 A_Q0 1k
R3786 A_Q0 VSS 4.5k
J_A2348 P224 !InvertAcc 0 DR
J_B1100 P226 !Acc0 0 DR
J_A2349 N040 Acc_INVing P228 DR
R3787 VDD N040 100k
J_F949 VDD N040 P229 DR
R3788 P229 N049 1k
R3789 N049 VSS 4.8k
J_B1101 P228 N039 0 DR
J_A2350 N044 N049 0 DR
R3790 VDD N044 50k
J_F950 VDD N044 P230 DR
R3791 P230 N054 1k
R3792 N054 VSS 4.5k
J_A2351 N068 Acc_INVing P231 DR
R3793 VDD N068 100k
J_F951 VDD N068 P232 DR
R3794 P232 N071 1k
R3795 N071 VSS 4.8k
J_B1102 P231 N038 0 DR
J_A2352 N070 N071 0 DR
R3796 VDD N070 50k
J_F952 VDD N070 P233 DR
R3797 P233 N073 1k
R3798 N073 VSS 4.5k
J_A2353 N041 N039 P234 DR
R3799 VDD N041 100k
J_F953 VDD N041 P235 DR
R3800 P235 N050 1k
R3801 N050 VSS 4.8k
J_B1103 P234 N054 P236 DR
J_A2354 N069 CLK P237 DR
R3802 VDD N069 100k
J_F954 VDD N069 P238 DR
R3803 P238 N072 1k
R3804 N072 VSS 4.8k
J_B1104 P237 N073 P239 DR
J_A2355 N045 N050 P240 DR
R3805 VDD N045 100k
J_F955 VDD N045 P241 DR
R3806 P241 N038 1k
R3807 N038 VSS 4.8k
J_B1105 P240 N039 0 DR
J_A2356 N064 N038 P242 DR
R3808 VDD N064 100k
J_F956 VDD N064 P243 DR
R3809 P243 N039 1k
R3810 N039 VSS 4.8k
J_B1106 P242 N072 0 DR
J_B1107 P236 CLK 0 DR
J_B1108 P239 N038 0 DR
J_A2357 N047 N038 0 DR
R3811 VDD N047 50k
J_F957 VDD N047 P244 DR
R3812 P244 !InvertAcc 1k
R3813 !InvertAcc VSS 4.5k
J_A2358 N060 !InvertAcc 0 DR
R3814 VDD N060 50k
J_F958 VDD N060 P245 DR
R3815 P245 InvertAcc 1k
R3816 InvertAcc VSS 4.5k
J_A2359 N161 Temp_INVing P246 DR
R3817 VDD N161 100k
J_F959 VDD N161 P247 DR
R3818 P247 N167 1k
R3819 N167 VSS 4.8k
J_B1109 P246 N157 0 DR
J_A2360 N164 N167 0 DR
R3820 VDD N164 50k
J_F960 VDD N164 P248 DR
R3821 P248 N169 1k
R3822 N169 VSS 4.5k
J_A2361 N187 Temp_INVing P249 DR
R3823 VDD N187 100k
J_F961 VDD N187 P250 DR
R3824 P250 N195 1k
R3825 N195 VSS 4.8k
J_B1110 P249 N156 0 DR
J_A2362 N190 N195 0 DR
R3826 VDD N190 50k
J_F962 VDD N190 P251 DR
R3827 P251 N199 1k
R3828 N199 VSS 4.5k
J_A2363 N162 N157 P252 DR
R3829 VDD N162 100k
J_F963 VDD N162 P253 DR
R3830 P253 N168 1k
R3831 N168 VSS 4.8k
J_B1111 P252 N169 P254 DR
J_A2364 N188 CLK P255 DR
R3832 VDD N188 100k
J_F964 VDD N188 P256 DR
R3833 P256 N196 1k
R3834 N196 VSS 4.8k
J_B1112 P255 N199 P257 DR
J_A2365 N165 N168 P258 DR
R3835 VDD N165 100k
J_F965 VDD N165 P259 DR
R3836 P259 N156 1k
R3837 N156 VSS 4.8k
J_B1113 P258 N157 0 DR
J_A2366 N186 N156 P260 DR
R3838 VDD N186 100k
J_F966 VDD N186 P261 DR
R3839 P261 N157 1k
R3840 N157 VSS 4.8k
J_B1114 P260 N196 0 DR
J_B1115 P254 CLK 0 DR
J_B1116 P257 N156 0 DR
J_A2367 N166 N156 0 DR
R3841 VDD N166 50k
J_F967 VDD N166 P262 DR
R3842 P262 !InvertTemp 1k
R3843 !InvertTemp VSS 4.5k
J_A2368 N181 !InvertTemp 0 DR
R3844 VDD N181 50k
J_F968 VDD N181 P263 DR
R3845 P263 InvertTemp 1k
R3846 InvertTemp VSS 4.5k
R4591 VDD EO_Out 100k
J_F1212 VDD EO_Out P264 DR
R4592 P264 !EO_Outing 1k
R4593 !EO_Outing VSS 4.8k
J_A2658 N034 !EO_Outing 0 DR
R4594 VDD N034 50k
J_A2659 VDD N034 P265 DR
R4595 P265 EO_Outing 1k
R4596 EO_Outing VSS 4.5k
R4597 VDD CF_INV 100k
J_F1213 VDD CF_INV P266 DR
R4598 P266 !InvertCF 1k
R4599 !InvertCF VSS 4.8k
J_A2660 N004 !InvertCF 0 DR
R4600 VDD N004 50k
J_A2661 VDD N004 P267 DR
R4601 P267 InvertCF 1k
R4602 InvertCF VSS 4.5k
J_A2662 N007 InvertCF P268 DR
R4603 VDD N007 100k
J_F1214 VDD N007 P269 DR
R4604 P269 N012 1k
R4605 N012 VSS 4.8k
J_B1242 P268 N006 0 DR
J_A2663 N009 N012 0 DR
R4606 VDD N009 50k
J_F1215 VDD N009 P270 DR
R4607 P270 N015 1k
R4608 N015 VSS 4.5k
J_A2664 N023 InvertCF P271 DR
R4609 VDD N023 100k
J_F1216 VDD N023 P272 DR
R4610 P272 N028 1k
R4611 N028 VSS 4.8k
J_B1243 P271 N005 0 DR
J_A2665 N026 N028 0 DR
R4612 VDD N026 50k
J_F1217 VDD N026 P273 DR
R4613 P273 N030 1k
R4614 N030 VSS 4.5k
J_A2666 N008 N006 P274 DR
R4615 VDD N008 100k
J_F1218 VDD N008 P275 DR
R4616 P275 N013 1k
R4617 N013 VSS 4.8k
J_B1244 P274 N015 P276 DR
J_A2667 N024 CLK P277 DR
R4618 VDD N024 100k
J_F1219 VDD N024 P278 DR
R4619 P278 N029 1k
R4620 N029 VSS 4.8k
J_B1245 P277 N030 P279 DR
J_A2668 N010 N013 P280 DR
R4621 VDD N010 100k
J_F1220 VDD N010 P281 DR
R4622 P281 N005 1k
R4623 N005 VSS 4.8k
J_B1246 P280 N006 0 DR
J_A2669 N021 N005 P282 DR
R4624 VDD N021 100k
J_F1221 VDD N021 P283 DR
R4625 P283 N006 1k
R4626 N006 VSS 4.8k
J_B1247 P282 N029 0 DR
J_B1248 P276 CLK 0 DR
J_B1249 P279 N005 0 DR
J_A2670 N011 N005 0 DR
R4627 VDD N011 50k
J_F1222 VDD N011 P284 DR
R4628 P284 !InvertCarry 1k
R4629 !InvertCarry VSS 4.5k
J_A2671 N020 !InvertCarry 0 DR
R4630 VDD N020 50k
J_F1223 VDD N020 P285 DR
R4631 P285 InvertCarry 1k
R4632 InvertCarry VSS 4.5k
J_A1 N242 A_Q2 P286 DR
R1 VDD N242 100k
J_F1 VDD N242 P287 DR
R2 P287 N249 1k
R3 N249 VSS 4.8k
J_B1 N242 CF_In P288 DR
J_A2 N245 N249 0 DR
R4 VDD N245 50k
J_A3 VDD N245 P289 DR
R5 P289 Temp3In 1k
R6 Temp3In VSS 4.5k
J_A4 P286 Shift_Left 0 DR
J_B2 P288 Shift_Right 0 DR
J_A5 N242 Bus3 P290 DR
J_A6 P290 !Shift_ 0 DR
J_A7 N243 A_Q1 P291 DR
R7 VDD N243 100k
J_F2 VDD N243 P292 DR
R8 P292 N250 1k
R9 N250 VSS 4.8k
J_B3 N243 A_Q3 P293 DR
J_A8 N246 N250 0 DR
R10 VDD N246 50k
J_A9 VDD N246 P294 DR
R11 P294 Temp2In 1k
R12 Temp2In VSS 4.5k
J_A10 P291 Shift_Left 0 DR
J_B4 P293 Shift_Right 0 DR
J_A11 N243 Bus2 P295 DR
J_A12 P295 !Shift_ 0 DR
J_A13 N255 A_Q0 P296 DR
R13 VDD N255 100k
J_F3 VDD N255 P297 DR
R14 P297 N264 1k
R15 N264 VSS 4.8k
J_B5 N255 A_Q2 P298 DR
J_A14 N260 N264 0 DR
R16 VDD N260 50k
J_A15 VDD N260 P299 DR
R17 P299 Temp1In 1k
R18 Temp1In VSS 4.5k
J_A16 P296 Shift_Left 0 DR
J_B6 P298 Shift_Right 0 DR
J_A17 N255 Bus1 P300 DR
J_A18 P300 !Shift_ 0 DR
J_A19 N256 CF_In P301 DR
R19 VDD N256 100k
J_F4 VDD N256 P302 DR
R20 P302 N265 1k
R21 N265 VSS 4.8k
J_B7 N256 A_Q1 P303 DR
J_A20 N261 N265 0 DR
R22 VDD N261 50k
J_A21 VDD N261 P304 DR
R23 P304 Temp0In 1k
R24 Temp0In VSS 4.5k
J_A22 P301 Shift_Left 0 DR
J_B8 P303 Shift_Right 0 DR
J_A23 N256 Bus0 P305 DR
J_A24 P305 !Shift_ 0 DR
J_A25 N259 A_Q3 P306 DR
R25 VDD N259 100k
J_F5 VDD N259 P307 DR
R26 P307 N266 1k
R27 N266 VSS 4.8k
J_B9 N259 A_Q0 P308 DR
J_A26 N262 N266 0 DR
R28 VDD N262 50k
J_A27 VDD N262 P309 DR
R29 P309 CarryInputIn 1k
R30 CarryInputIn VSS 4.5k
J_A28 P306 Shift_Left 0 DR
J_B10 P308 Shift_Right 0 DR
J_A29 N259 SUMCF P310 DR
J_A30 P310 !Shift_ 0 DR
R31 VDD Shift_Enable 100k
J_F6 VDD Shift_Enable P311 DR
R32 P311 !Shift_ 1k
R33 !Shift_ VSS 4.8k
J_A31 N241 !Shift_ 0 DR
R34 VDD N241 50k
J_A32 VDD N241 P312 DR
R35 P312 N248 1k
R36 N248 VSS 4.5k
R37 VDD Shift_Direction 100k
J_F7 VDD Shift_Direction P313 DR
R38 P313 N257 1k
R39 N257 VSS 4.8k
J_A33 N253 N257 0 DR
R40 VDD N253 50k
J_A34 VDD N253 P314 DR
R41 P314 N252 1k
R42 N252 VSS 4.5k
R43 VDD N244 100k
J_F8 VDD N244 P315 DR
R44 P315 N251 1k
R45 N251 VSS 4.8k
J_B11 N244 N248 P316 DR
J_A35 N247 N251 0 DR
R46 VDD N247 50k
J_A36 VDD N247 P317 DR
R47 P317 Shift_Left 1k
R48 Shift_Left VSS 4.5k
J_B12 P316 N252 0 DR
R49 VDD N254 100k
J_F9 VDD N254 P318 DR
R50 P318 N263 1k
R51 N263 VSS 4.8k
J_B13 N254 N248 P319 DR
J_A37 N258 N263 0 DR
R52 VDD N258 50k
J_A38 VDD N258 P320 DR
R53 P320 Shift_Right 1k
R54 Shift_Right VSS 4.5k
J_B14 P319 N257 0 DR
J_A39 N032 CF0 P321 DR
R55 VDD N032 100k
J_F10 VDD N032 P322 DR
R56 P322 !CF 1k
R57 !CF VSS 4.8k
J_B15 N032 InvertCarry P323 DR
J_A40 N033 !CF 0 DR
R58 VDD N033 50k
J_A41 VDD N033 P324 DR
R59 P324 CF_In 1k
R60 CF_In VSS 4.5k
J_A42 P321 !InvertCarry 0 DR
J_B16 P323 !CF0 0 DR
R61 VDD CFStage1_Load 100k
J_F11 VDD CFStage1_Load P325 DR
R62 P325 !CFStage1_Loading 1k
R63 !CFStage1_Loading VSS 4.8k
J_A43 N035 !CFStage1_Loading 0 DR
R64 VDD N035 50k
J_A44 VDD N035 P326 DR
R65 P326 CFStage1_Loading 1k
R66 CFStage1_Loading VSS 4.5k
J_A45 CFStage1_Load EO_Outing 0 DR
.model NJF NJF
.model PJF PJF
.lib standard.jft
* ALU
* AZ
* Temp Inverter
* Accumulator
* CF In
* Temporary Register
* A>9
* CF Bus Out
* Acc Inverter
* CF Inverter
.backanno
.end